# Altium schematic sheet Page04 CPU PWR.SchDoc
size 513 x 386 mm
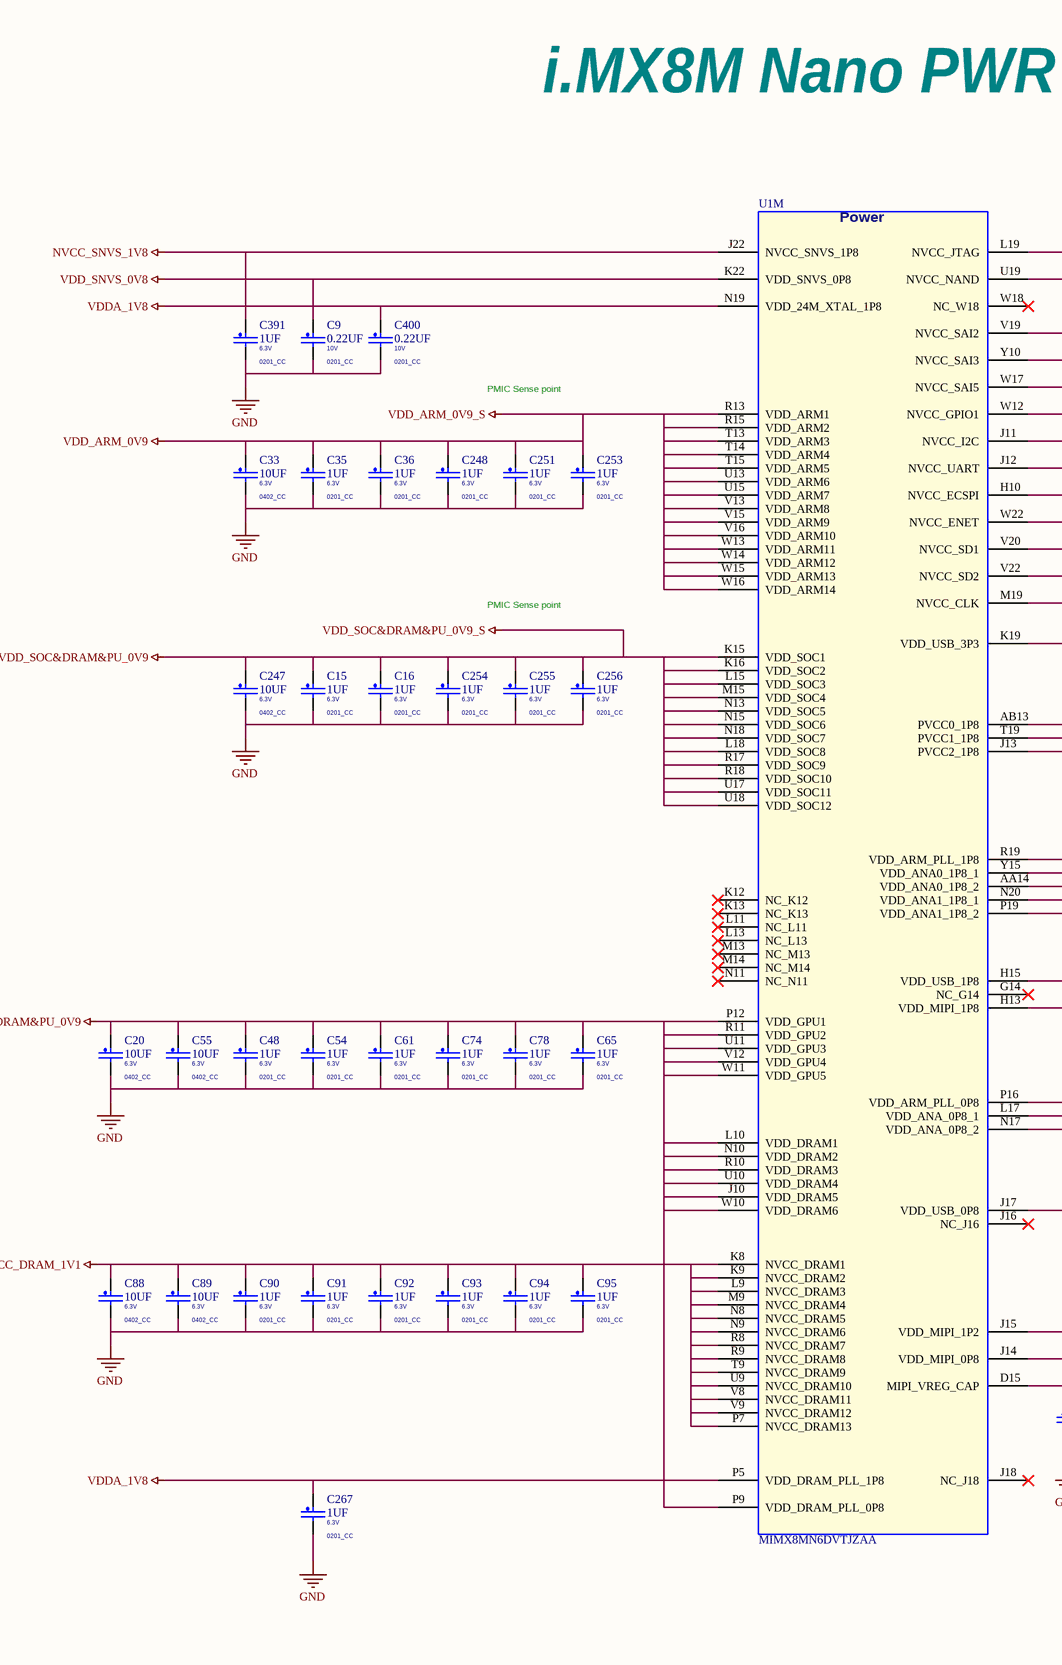
[diagram p0: Page04 CPU PWR.SchDoc, left]
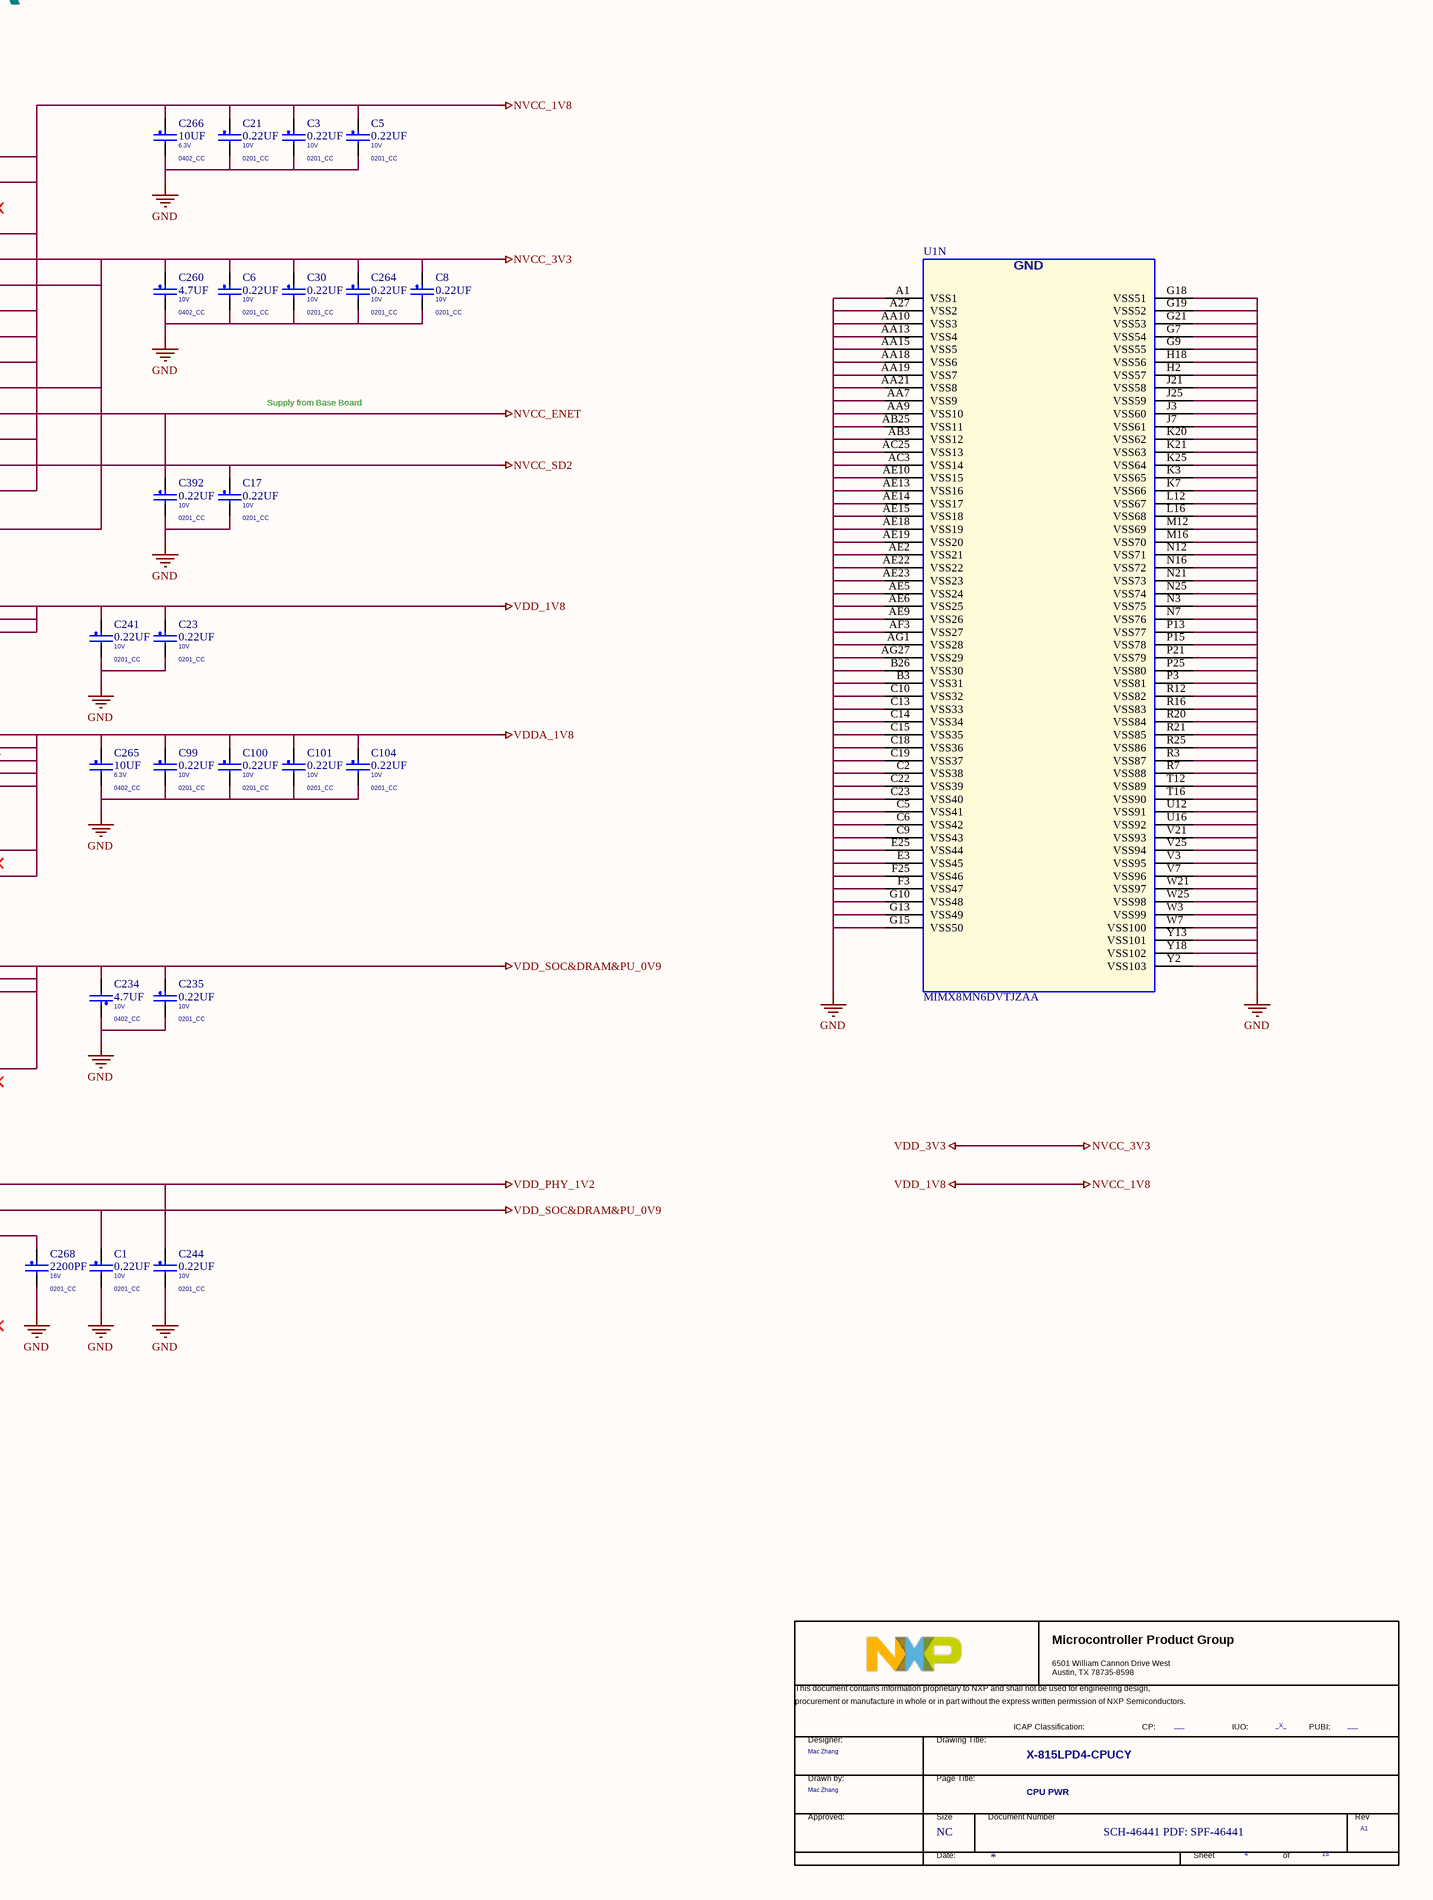
[diagram p1: Page04 CPU PWR.SchDoc, right]

## Parts
*  Doc: SCH-46441 PDF: SPF-46441  RevCode: A1  Title: X-815LPD4-CPUCY  Page Size: NC  Page Number: 4  Page Count: 13  PageTitle: CPU PWR  Designer: Mac Zhang  PUBI: ___  FIUO: _X_  (hidden comment: TitleBlock_MCPG)  (graphical)
C1  0.22UF  VOLTAGE: 10V  [0201_CC]
C3  0.22UF  VOLTAGE: 10V  [0201_CC]
C5  0.22UF  VOLTAGE: 10V  [0201_CC]
C6  0.22UF  VOLTAGE: 10V  [0201_CC]
C8  0.22UF  VOLTAGE: 10V  [0201_CC]
C9  0.22UF  VOLTAGE: 10V  [0201_CC]
C15  1UF  VOLTAGE: 6.3V  [0201_CC]
C16  1UF  VOLTAGE: 6.3V  [0201_CC]
C17  0.22UF  VOLTAGE: 10V  [0201_CC]
C20  10UF  VOLTAGE: 6.3V  [0402_CC]
C21  0.22UF  VOLTAGE: 10V  [0201_CC]
C23  0.22UF  VOLTAGE: 10V  [0201_CC]
C30  0.22UF  VOLTAGE: 10V  [0201_CC]
C33  10UF  VOLTAGE: 6.3V  [0402_CC]
C35  1UF  VOLTAGE: 6.3V  [0201_CC]
C36  1UF  VOLTAGE: 6.3V  [0201_CC]
C48  1UF  VOLTAGE: 6.3V  [0201_CC]
C54  1UF  VOLTAGE: 6.3V  [0201_CC]
C55  10UF  VOLTAGE: 6.3V  [0402_CC]
C61  1UF  VOLTAGE: 6.3V  [0201_CC]
C65  1UF  VOLTAGE: 6.3V  [0201_CC]
C74  1UF  VOLTAGE: 6.3V  [0201_CC]
C78  1UF  VOLTAGE: 6.3V  [0201_CC]
C88  10UF  VOLTAGE: 6.3V  [0402_CC]
C89  10UF  VOLTAGE: 6.3V  [0402_CC]
C90  1UF  VOLTAGE: 6.3V  [0201_CC]
C91  1UF  VOLTAGE: 6.3V  [0201_CC]
C92  1UF  VOLTAGE: 6.3V  [0201_CC]
C93  1UF  VOLTAGE: 6.3V  [0201_CC]
C94  1UF  VOLTAGE: 6.3V  [0201_CC]
C95  1UF  VOLTAGE: 6.3V  [0201_CC]
C99  0.22UF  VOLTAGE: 10V  [0201_CC]
C100  0.22UF  VOLTAGE: 10V  [0201_CC]
C101  0.22UF  VOLTAGE: 10V  [0201_CC]
C104  0.22UF  VOLTAGE: 10V  [0201_CC]
C234  4.7UF  VOLTAGE: 10V  [0402_CC]
C235  0.22UF  VOLTAGE: 10V  [0201_CC]
C241  0.22UF  VOLTAGE: 10V  [0201_CC]
C244  0.22UF  VOLTAGE: 10V  [0201_CC]
C247  10UF  VOLTAGE: 6.3V  [0402_CC]
C248  1UF  VOLTAGE: 6.3V  [0201_CC]
C251  1UF  VOLTAGE: 6.3V  [0201_CC]
C253  1UF  VOLTAGE: 6.3V  [0201_CC]
C254  1UF  VOLTAGE: 6.3V  [0201_CC]
C255  1UF  VOLTAGE: 6.3V  [0201_CC]
C256  1UF  VOLTAGE: 6.3V  [0201_CC]
C260  4.7UF  VOLTAGE: 10V  [0402_CC]
C264  0.22UF  VOLTAGE: 10V  [0201_CC]
C265  10UF  VOLTAGE: 6.3V  [0402_CC]
C266  10UF  VOLTAGE: 6.3V  [0402_CC]
C267  1UF  VOLTAGE: 6.3V  [0201_CC]
C268  2200PF  VOLTAGE: 16V  [0201_CC]
C391  1UF  VOLTAGE: 6.3V  [0201_CC]
C392  0.22UF  VOLTAGE: 10V  [0201_CC]
C400  0.22UF  VOLTAGE: 10V  [0201_CC]
U1  MIMX8MN6DVTJZAA  [bga486_0p5_14x14]  (parts M,N of 14)

## Nets
GND: C1.2 C3.2 C5.2 C6.2 C8.2 C9.2 C15.2 C16.2 C17.2 C20.2 C21.2 C23.2 C30.2 C33.2 C35.2 C36.2 C48.2 C54.2 C55.2 C61.2 C65.2 C74.2 C78.2 C88.2 C89.2 C90.2 C91.2 C92.2 C93.2 C94.2 C95.2 C99.2 C100.2 C101.2 C104.2 C234.1 C235.2 C241.2 C244.2 C247.2 C248.2 C251.2 C253.2 C254.2 C255.2 C256.2 C260.2 C264.2 C265.2 C266.2 C267.2 C268.2 C391.2 C392.2 C400.2 U1.A1(VSS1) U1.A27(VSS2) U1.AA7(VSS9) U1.AA9(VSS10) U1.AA10(VSS3) U1.AA13(VSS4) U1.AA15(VSS5) U1.AA18(VSS6) U1.AA19(VSS7) U1.AA21(VSS8) U1.AB3(VSS12) U1.AB25(VSS11) U1.AC3(VSS14) U1.AC25(VSS13) U1.AE2(VSS21) U1.AE5(VSS24) U1.AE6(VSS25) U1.AE9(VSS26) U1.AE10(VSS15) U1.AE13(VSS16) U1.AE14(VSS17) U1.AE15(VSS18) U1.AE18(VSS19) U1.AE19(VSS20) U1.AE22(VSS22) U1.AE23(VSS23) U1.AF3(VSS27) U1.AG1(VSS28) U1.AG27(VSS29) U1.B3(VSS31) U1.B26(VSS30) U1.C2(VSS38) U1.C5(VSS41) U1.C6(VSS42) U1.C9(VSS43) U1.C10(VSS32) U1.C13(VSS33) U1.C14(VSS34) U1.C15(VSS35) U1.C18(VSS36) U1.C19(VSS37) U1.C22(VSS39) U1.C23(VSS40) U1.E3(VSS45) U1.E25(VSS44) U1.F3(VSS47) U1.F25(VSS46) U1.G7(VSS54) U1.G9(VSS55) U1.G10(VSS48) U1.G13(VSS49) U1.G15(VSS50) U1.G18(VSS51) U1.G19(VSS52) U1.G21(VSS53) U1.H2(VSS57) U1.H18(VSS56) U1.J3(VSS60) U1.J7(VSS61) U1.J21(VSS58) U1.J25(VSS59) U1.K3(VSS65) U1.K7(VSS66) U1.K20(VSS62) U1.K21(VSS63) U1.K25(VSS64) U1.L12(VSS67) U1.L16(VSS68) U1.M12(VSS69) U1.M16(VSS70) U1.N3(VSS75) U1.N7(VSS76) U1.N12(VSS71) U1.N16(VSS72) U1.N21(VSS73) U1.N25(VSS74) U1.P3(VSS81) U1.P13(VSS77) U1.P15(VSS78) U1.P21(VSS79) U1.P25(VSS80) U1.R3(VSS87) U1.R7(VSS88) U1.R12(VSS82) U1.R16(VSS83) U1.R20(VSS84) U1.R21(VSS85) U1.R25(VSS86) U1.T12(VSS89) U1.T16(VSS90) U1.U12(VSS91) U1.U16(VSS92) U1.V3(VSS95) U1.V7(VSS96) U1.V21(VSS93) U1.V25(VSS94) U1.W3(VSS99) U1.W7(VSS100) U1.W21(VSS97) U1.W25(VSS98) U1.Y2(VSS103) U1.Y13(VSS101) U1.Y18(VSS102)
NVCC_1V8: C3.1 C5.1 C21.1 C23.1 C241.1 C266.1 U1.AB13(PVCC0_1P8) U1.J11(NVCC_I2C) U1.J12(NVCC_UART) U1.J13(PVCC2_1P8) U1.L19(NVCC_JTAG) U1.M19(NVCC_CLK) U1.T19(PVCC1_1P8) U1.U19(NVCC_NAND) U1.V19(NVCC_SAI2) U1.V20(NVCC_SD1) U1.W12(NVCC_GPIO1)  [also labelled VDD_1V8]
NVCC_3V3: C6.1 C8.1 C30.1 C260.1 C264.1 U1.H10(NVCC_ECSPI) U1.K19(VDD_USB_3P3) U1.W17(NVCC_SAI5) U1.Y10(NVCC_SAI3)  [also labelled VDD_3V3]
NVCC_DRAM_1V1: C88.1 C89.1 C90.1 C91.1 C92.1 C93.1 C94.1 C95.1 U1.K8(NVCC_DRAM1) U1.K9(NVCC_DRAM2) U1.L9(NVCC_DRAM3) U1.M9(NVCC_DRAM4) U1.N8(NVCC_DRAM5) U1.N9(NVCC_DRAM6) U1.P7(NVCC_DRAM13) U1.R8(NVCC_DRAM7) U1.R9(NVCC_DRAM8) U1.T9(NVCC_DRAM9) U1.U9(NVCC_DRAM10) U1.V8(NVCC_DRAM11) U1.V9(NVCC_DRAM12)
NVCC_ENET: C392.1 U1.W22(NVCC_ENET)
NVCC_SD2: C17.1 U1.V22(NVCC_SD2)
NVCC_SNVS_1V8: C391.1 U1.J22(NVCC_SNVS_1P8)
VDD_ARM_0V9: C33.1 C35.1 C36.1 C248.1 C251.1 C253.1 U1.R13(VDD_ARM1) U1.R15(VDD_ARM2) U1.T13(VDD_ARM3) U1.T14(VDD_ARM4) U1.T15(VDD_ARM5) U1.U13(VDD_ARM6) U1.U15(VDD_ARM7) U1.V13(VDD_ARM8) U1.V15(VDD_ARM9) U1.V16(VDD_ARM10) U1.W13(VDD_ARM11) U1.W14(VDD_ARM12) U1.W15(VDD_ARM13) U1.W16(VDD_ARM14)  [also labelled VDD_ARM_0V9_S]
VDD_PHY_1V2: C244.1 U1.J15(VDD_MIPI_1P2)
VDD_SNVS_0V8: C9.1 U1.K22(VDD_SNVS_0P8)
VDD_SOC&DRAM&PU_0V9: C1.1 C15.1 C16.1 C20.1 C48.1 C54.1 C55.1 C61.1 C65.1 C74.1 C78.1 C234.2 C235.1 C247.1 C254.1 C255.1 C256.1 U1.J10(VDD_DRAM5) U1.J14(VDD_MIPI_0P8) U1.J17(VDD_USB_0P8) U1.K15(VDD_SOC1) U1.K16(VDD_SOC2) U1.L10(VDD_DRAM1) U1.L15(VDD_SOC3) U1.L17(VDD_ANA_0P8_1) U1.L18(VDD_SOC8) U1.M15(VDD_SOC4) U1.N10(VDD_DRAM2) U1.N13(VDD_SOC5) U1.N15(VDD_SOC6) U1.N17(VDD_ANA_0P8_2) U1.N18(VDD_SOC7) U1.P9(VDD_DRAM_PLL_0P8) U1.P12(VDD_GPU1) U1.P16(VDD_ARM_PLL_0P8) U1.R10(VDD_DRAM3) U1.R11(VDD_GPU2) U1.R17(VDD_SOC9) U1.R18(VDD_SOC10) U1.U10(VDD_DRAM4) U1.U11(VDD_GPU3) U1.U17(VDD_SOC11) U1.U18(VDD_SOC12) U1.V12(VDD_GPU4) U1.W10(VDD_DRAM6) U1.W11(VDD_GPU5)  [also labelled VDD_SOC&DRAM&PU_0V9_S]
VDDA_1V8: C99.1 C100.1 C101.1 C104.1 C265.1 C267.1 C400.1 U1.AA14(VDD_ANA0_1P8_2) U1.H13(VDD_MIPI_1P8) U1.H15(VDD_USB_1P8) U1.N19(VDD_24M_XTAL_1P8) U1.N20(VDD_ANA1_1P8_1) U1.P5(VDD_DRAM_PLL_1P8) U1.P19(VDD_ANA1_1P8_2) U1.R19(VDD_ARM_PLL_1P8) U1.Y15(VDD_ANA0_1P8_1)
NetC268_1: C268.1 U1.D15(MIPI_VREG_CAP)

Not connected (* = marked no-connect by the designer): U1 G14(NC_G14)* J16(NC_J16)* J18(NC_J18)* K12(NC_K12)* K13(NC_K13)* L11(NC_L11)* L13(NC_L13)* M13(NC_M13)* M14(NC_M14)* N11(NC_N11)* W18(NC_W18)*

## Notes on the sheet
- i.MX8M Nano PWR
- PMIC Sense point
- Supply from Base Board
- (in symbol MIMX8NN_BGA486P, part M) Power
- (in symbol MIMX8NN_BGA486P, part N) GND
- (in symbol TitleBlock_MCPG) Microcontroller Product Group; 6501 William Cannon Drive West / Austin, TX 78735-8598; This document contains information proprietary to NXP and shall not be used for engineering design,; procurement or manufacture in whole or in part without the express written permission of NXP Semiconductors.; ICAP Classification:; CP:; IUO:; PUBI:; Designer:; Drawing Title:; Drawn by:; Page Title:; Approved:; Size; Document Number; Rev; Date:; Sheet; of

## Library data of the parts
* = TitleBlock_MCPG: OrgAddr1: NO. 192 Liangjing Rd. Pudong New Area, ShangHai; OrgName: NXP Semiconductor; Page Create Date: March  8, 1995; DrawnBy: Mac Zhang; FCP: ___; Page Modify Date: *
C1 = CAP_NP: CAP CER 0.22UF 10V 20% X5R 0201; CLASS: DISCRETE; FPLIST: CC0201,CC0201_HD,0201_CC,CC_0201_CIR,0201_CC_012SM_NSP; CAD_APPROVED: Yes; MFG_PN01: LMK063BJ224MP-F; MFG_NAME01: Taiyo Yuden; AGILE_PN: 150-78815; HEIGHT: 0.33MM; ROHS: Yes; Tolerance: 20%; PCB Footprint: 0201_CC
C3 C6 C8 C9 C17 C100 C104 C235 C264 C400 = CAP_NP: CAP CER 0.22UF 10V 20% X5R 0201; CLASS: DISCRETE; FPLIST: CC0201,CC0201_HD,0201_CC; CAD_APPROVED: Yes; MFG_PN01: LMK063BJ224MP-F; MFG_NAME01: Taiyo Yuden; AGILE_PN: 150-78815; HEIGHT: 0.33MM; ROHS: Yes; Tolerance: 20%; PCB Footprint: 0201_CC
C5 C21 C23 C99 C101 C241 C392 = CAP_NP: CAP CER 0.22UF 10V 20% X5R 0201; CLASS: DISCRETE; AGILE_PN: 150-78815; MFG_NAME01: Taiyo Yuden; MFG_PN01: LMK063BJ224MP-F; CAD_APPROVED: Yes; FPLIST: CC0201,CC0201_HD,0201_CC; Tolerance: 20%; ROHS: Yes; HEIGHT: 0.33MM; PCB Footprint: 0201_CC
C15 C16 C35 C36 C48 C61 C65 C78 C90-C92 C95 C248 C251 C253 C254 C256 C391 = CAP_NP: CAP CER 1uF 6.3V 20% X5R 0201; CLASS: DISCRETE; FPLIST: CC0201,CC0201_HD,0201_CC,0201_CC_012SM_NSP; CAD_APPROVED: Yes; MFG_PN01: 02016D105MAT2A; MFG_NAME01: AVX; AGILE_PN: 150-79407; HEIGHT: 0.35MM; ROHS: Yes; Tolerance: 20%; PCB Footprint: 0201_CC; Package Size: 0201; Package Type: 7¡± reel
C20 C88 C247 = CAP_NP: CAP CER 10UF 6.3V 20% X5R 0402; CLASS: DISCRETE; FPLIST: CC0402_25,CC0402_HD,0402_CC; CAD_APPROVED: Yes; MFG_PN01: CL05A106MQ5NUNC; MFG_NAME01: SAMSUNG ELECTRO MECHANICS; AGILE_PN: 150-79163; HEIGHT: 0.65 MM; ROHS: Yes; Tolerance: 20%; PCB Footprint: 0402_CC
C30 = CAP_NP: CAP CER 0.22UF 10V 20% X5R 0201; CLASS: DISCRETE; FPLIST: CC0201,CC0201_HD,0201_CC,0201_CC_012SM_NSP; CAD_APPROVED: Yes; MFG_PN01: LMK063BJ224MP-F; MFG_NAME01: Taiyo Yuden; AGILE_PN: 150-78815; HEIGHT: 0.33MM; ROHS: Yes; Tolerance: 20%; PCB Footprint: 0201_CC
C33 C55 C89 C265 C266 = CAP_NP: CAP CER 10UF 6.3V 20% X5R 0402; CLASS: DISCRETE; AGILE_PN: 150-79163; MFG_NAME01: SAMSUNG ELECTRO MECHANICS; MFG_PN01: CL05A106MQ5NUNC; CAD_APPROVED: Yes; FPLIST: CC0402_25,CC0402_HD,0402_CC; Tolerance: 20%; ROHS: Yes; HEIGHT: 0.65 MM; PCB Footprint: 0402_CC
C54 C74 C93 C94 C255 C267 = CAP_NP: CAP CER 1uF 6.3V 20% X5R 0201; CLASS: DISCRETE; AGILE_PN: 150-79407; MFG_NAME01: AVX; MFG_PN01: 02016D105MAT2A; CAD_APPROVED: Yes; FPLIST: CC0201,CC0201_HD,0201_CC,0201_CC_012SM_NSP; Tolerance: 20%; ROHS: Yes; HEIGHT: 0.35MM; PCB Footprint: 0201_CC; Package Size: 0201; Package Type: 7¡± reel
C234 C260 = CAP_NP: CAP CER 4.7uF 10V 10% X5R 0402; CLASS: DISCRETE; AGILE_PN: 150-80044; MFG_NAME01: Samsung Electro Mechanics; MFG_PN01: CL05A475KP5NRNC; CAD_APPROVED: Yes; FPLIST: CC0402_25,CC0402_HD,0402_CC; Tolerance: 10%; ROHS: Yes; HEIGHT: 0.65MM; PCB Footprint: 0402_CC
C244 = CAP_NP: CAP CER 0.22UF 10V 20% X5R 0201; CLASS: DISCRETE; AGILE_PN: 150-78815; MFG_NAME01: Taiyo Yuden; MFG_PN01: LMK063BJ224MP-F; CAD_APPROVED: Yes; FPLIST: CC0201,CC0201_HD,0201_CC,CC_0201_CIR,0201_CC_012SM_NSP; Tolerance: 20%; ROHS: Yes; HEIGHT: 0.33MM; PCB Footprint: 0201_CC
C268 = CAP_NP: CAP CER 2200PF 16V 10% X7R 0201; CLASS: DISCRETE; FPLIST: CC0201,CC0201_HD,0201_CC; CAD_APPROVED: Yes; MFG_PN01: GRM033R71C222KA88D; MFG_NAME01: MURATA; Tolerance: 20%; AGILE_PN: 150-78660; HEIGHT: 0.33 MM; ROHS: Yes; PCB Footprint: 0201_CC
U1 = MIMX8NN_BGA486P: IC CPU QUAD CORTEX A53+M7 1.5GHZ BGA486; AGILE_PN: TMP-WF-35485; MFG_NAME01: NXP SEMICONDUCTORS; Temp_Range: 0¡ãC to 95¡ãC; PRE_APN: 330-77106; CAD_APPROVED: Yes; CLASS: IC; MFG_PN01: MIMX8MN6DVTJZAA; ROHS: Yes; HEIGHT: 1.25MM; PCB Footprint: bga486_0p5_14x14; Temp Range: 0¡ãC to 95¡ãC